# Altium schematic sheet 1_P1.schdoc
size 429 x 307 mm; Symbol: Sheet-Symbol_A4; Device: Sheet-Symbol_A4; Company: 嘉立创EDA; Version: V1.0; Page Size: A4; @Project Name: BMCU-V0.6; @Page Count: 1; @Update Date: 2025-03-16; @Create Date: 2024-12-15; @Schematic Name: Schematic1_1; @Page No: 1; @Page Name: P1; Title Block Position: 3; Width: 1655; Height: 1170; Region Start: 1; X Region Count: 6; Y Region Count: 4; Blade Width: 10; @Board Name: 组件板; @Create Time: 07:27:27; @Update Time: 17:54:20
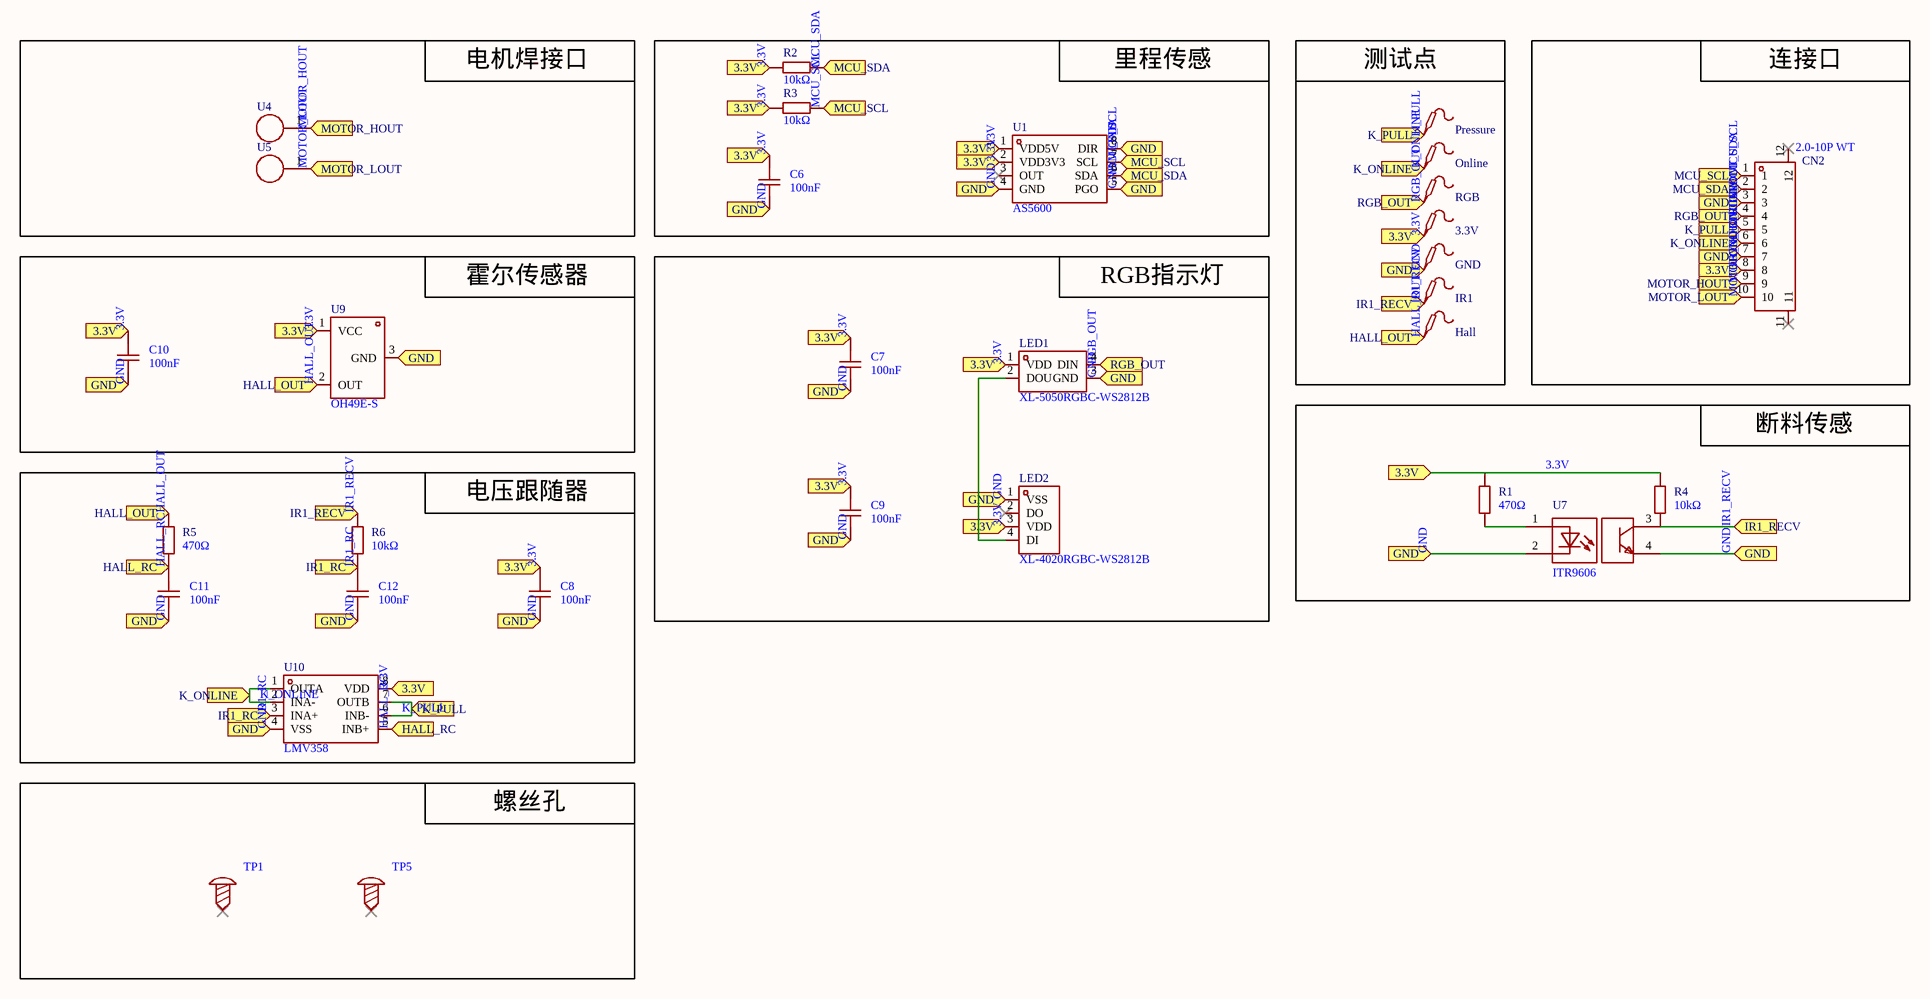
[diagram p0: 1_P1.schdoc]

## Parts
3.3V  (no value)  [Test-Point-0.5mm]
C6  100nF  [C0603]
C7  100nF  [C0603]
C8  100nF  [C0603]
C9  100nF  [C0603]
C10  100nF  [C0603]
C11  100nF  [C0603]
C12  100nF  [C0603]
CN2  2.0-10P WT  [CONN-SMD_10P-P2.00_2.0-10P-WT]
GND  (no value)  [Test-Point-0.5mm]
Hall  (no value)  [Test-Point-0.5mm]
IR1  (no value)  [Test-Point-0.5mm]
LED1  XL-5050RGBC-WS2812B  [LED-SMD_4P-L5.0-W5.0-BL_XL-5050RGBC]
LED2  XL-4020RGBC-WS2812B  [LED-SMD_4P-L4.0-W1.7_XL-4020RGBC-WS2812B]
Online  (no value)  [Test-Point-0.5mm]
Pressure  (no value)  [Test-Point-0.5mm]
R1  470Ω  [R0603]
R2  10kΩ  [R0603]
R3  10kΩ  [R0603]
R4  10kΩ  [R0603]
R5  470Ω  [R0603]
R6  10kΩ  [R0603]
RGB  (no value)  [Test-Point-0.5mm]
TP1  (no value)  [M2螺丝]
TP5  (no value)  [M2螺丝]
U1  AS5600  [SOIC-8_L4.9-W3.9-P1.27-LS6.0-BL]
U4  1625854-2  [TEST-RING]  (value not drawn)
U5  1625854-2  [TEST-RING]  (value not drawn)
U7  ITR9606  [OPTO-TH_4P_ITR9606]
U9  OH49E-S  [SOT-23-3_L2.9-W1.6-P1.90-LS2.8-BR]
U10  LMV358  [SOP-8_L4.9-W3.9-P1.27-LS6.0-BL]

## Blocks framed on the sheet
电机焊接口: U4 U5
里程传感: C6 R2 R3 U1
测试点: 3.3V GND Hall IR1 Online Pressure RGB
连接口: CN2
霍尔传感器: C10 U9
RGB指示灯: C7 C9 LED1 LED2
断料传感: R1 R4 U7
电压跟随器: C8 C11 C12 R5 R6 U10
螺丝孔: TP1 TP5

## Ports
3.3V (in), GND (in), HALL_OUT (in), HALL_RC (in), IR1_RC (in), IR1_RECV (in), K_ONLINE (in), K_PULL (in), MCU_SCL (in), MCU_SDA (in), MOTOR_HOUT (in), MOTOR_LOUT (in), RGB_OUT (in)

## Nets
3.3V: 3.3V.1 C6.2 C7.2 C8.2 C9.2 C10.2 CN2.8 LED1.1(VDD) LED2.3(VDD) R1.1 R2.1 R3.1 R4.1 U1.1(VDD5V) U1.2(VDD3V3) U9.1(VCC) U10.8(VDD) ; port 3.3V
GND: C6.1 C7.1 C8.1 C9.1 C10.1 C11.1 C12.1 CN2.3 CN2.7 GND.1 LED1.3(GND) LED2.1(VSS) U1.4(GND) U1.5(PGO) U1.8(DIR) U7.2 U7.4 U9.3(GND) U10.4(VSS) ; port GND
HALL_OUT: Hall.1 R5.1 U9.2(OUT) ; port HALL_OUT
HALL_RC: C11.2 R5.2 U10.5(INB+) ; port HALL_RC
IR1_RC: C12.2 R6.1 U10.3(INA+) ; port IR1_RC
IR1_RECV: IR1.1 R4.2 R6.2 U7.3 ; port IR1_RECV
K_ONLINE: CN2.6 Online.1 U10.1(OUTA) U10.2(INA-) ; port K_ONLINE
K_PULL: CN2.5 Pressure.1 U10.6(INB-) U10.7(OUTB) ; port K_PULL
MCU_SCL: CN2.1 R3.2 U1.7(SCL) ; port MCU_SCL
MCU_SDA: CN2.2 R2.2 U1.6(SDA) ; port MCU_SDA
MOTOR_HOUT: CN2.9 U4.1 ; port MOTOR_HOUT
MOTOR_LOUT: CN2.10 U5.1 ; port MOTOR_LOUT
RGB_OUT: CN2.4 LED1.4(DIN) RGB.1 ; port RGB_OUT
NetLED1_2: LED1.2(DOU) LED2.4(DI)
NetR1_2: R1.2 U7.1

Not connected (* = marked no-connect by the designer): CN2 11* 12*; LED2 2(DO)*; TP1 1*; TP5 1*; U1 3(OUT)*

## Notes on the sheet
- 1
- 2
- 3
- 4
- 5
- 6
- A
- B
- C
- 原理图
- Schematic1_1
- 创建日期
- 更新日期
- 2025-03-16
- 2024-12-15
- D
- 绘制
- 图页
- P1
- 物料编码
- 审阅
- 版本
- 尺寸
- BMCU-V0.6
- 页
- 共
- V1.0
- A4
- 嘉立创EDA

## Library data of the parts
3.3V GND Hall IR1 Online Pressure RGB = Test-Point: Add into BOM: yes; Symbol: Test-Point; Device: Test-Point; Convert to PCB: yes
C6-C12 = CC0603KRX7R9BB104: Manufacturer: YAGEO(国巨); Symbol: CapAcitance; Add into BOM: yes; Tolerance: ±10%; Voltage Rated: 50V; Temperature Coefficient: X7R; Device: CC0603KRX7R9BB104; LCSC Part Name: 100nF ±10% 50V; Supplier Part: C14663; Manufacturer Part: CC0603KRX7R9BB104; Supplier Footprint: 0603; JLCPCB Part Class: Basic Part; Datasheet: https://atta.szlcsc.com/upload/public/pdf/source/20180910/C282072_33301C7F631E79921B82A8DAC6BCC5B3.pdf; Supplier: LCSC; Convert to PCB: yes; Value: 100nF
CN2 = 2.0-10P WT: Manufacturer: SHOU HAN(首韩); Add into BOM: yes; Pins Structure: 1x10P; Pitch: 2mm; Reference Series: PH; Number of PINs Per Row: 10; Current Rating (Max): 2A; Symbol: 2.0-10P WT; Device: 2.0-10P WT; LCSC Part Name: 间距:2mm 1x10P 卧贴; Supplier Part: C5340818; Manufacturer Part: 2.0-10P WT; Supplier Footprint: SMD,P=2mm,卧贴; Datasheet: https://atta.szlcsc.com/upload/public/pdf/source/20221228/2B469FB976A3BE7FA48F92FFEBDB46D7.pdf; Supplier: LCSC; Convert to PCB: yes; Mounting Style: 卧贴; Number of Pins: 10P; Number of Rows: 1; Operating Temperature Range: -25℃~+85℃
LED1 = XL-5050RGBC-WS2812B: Manufacturer: XINGLIGHT(成兴光); Add into BOM: yes; Symbol: XL-5050RGBC-WS2812B; Device: XL-5050RGBC-WS2812B; LCSC Part Name: XL-5050RGBC-WS2812B; Supplier Part: C2843785; Manufacturer Part: XL-5050RGBC-WS2812B; Supplier Footprint: SMD5050; Datasheet: https://atta.szlcsc.com/upload/public/pdf/source/20240412/E1004CAA80592E31D08BFE019083806F.pdf; Supplier: LCSC; Convert to PCB: yes
LED2 = XL-4020RGBC-WS2812B: Manufacturer: XINGLIGHT(成兴光); Add into BOM: yes; Symbol: XL-4020RGBC-WS2812B; Device: XL-4020RGBC-WS2812B; LCSC Part Name: XL-4020RGBC-WS2812B; Supplier Part: C3647024; Manufacturer Part: XL-4020RGBC-WS2812B; Supplier Footprint: SMD,2x4mm; JLCPCB Part Class: 扩展库; Datasheet: https://atta.szlcsc.com/upload/public/pdf/source/20240229/191D5186283B54A17967D79876487C73.pdf; Supplier: LCSC; Convert to PCB: yes
R1 R5 = 0603WAF4700T5E: Manufacturer: UNI-ROYAL(厚声); Add into BOM: yes; Tolerance: ±1%; Power(Watts): 100mW; Overload Voltage (Max): 75V; Temperature Coefficient: ±100ppm/℃; Symbol: 0603WAF4700T5E; Device: 0603WAF4700T5E; LCSC Part Name: 470Ω ±1% 100mW 厚膜电阻; Supplier Part: C23179; Manufacturer Part: 0603WAF4700T5E; Supplier Footprint: 0603; Datasheet: https://atta.szlcsc.com/upload/public/pdf/source/20200306/C422600_1E6D84923E4A46A82E41ADD87F860B5C.pdf; Supplier: LCSC; Convert to PCB: yes; Type: 厚膜电阻; Value: 470Ω; Operating Temperature Range: -55℃~+155℃
R2-R4 R6 = 0603WAF1002T5E: Manufacturer: UNI-ROYAL(厚声); Add into BOM: yes; Tolerance: ±1%; Power(Watts): 100mW; Overload Voltage (Max): 75V; Temperature Coefficient: ±100ppm/℃; Symbol: 0603WAF1002T5E; Device: 0603WAF1002T5E; LCSC Part Name: 厚膜电阻 10kΩ ±1% 100mW; Supplier Part: C25804; Manufacturer Part: 0603WAF1002T5E; Supplier Footprint: 0603; JLCPCB Part Class: 基础库; Datasheet: https://atta.szlcsc.com/upload/public/pdf/source/20200306/C422600_1E6D84923E4A46A82E41ADD87F860B5C.pdf; Supplier: LCSC; Convert to PCB: yes; Type: 厚膜电阻; Value: 10kΩ; Operating Temperature Range: -55℃~+155℃
TP1 TP5 = M2螺丝: Symbol: 螺丝孔; Convert to PCB: yes; Device: M2螺丝; Add into BOM: yes; Supplier Footprint: 插件
U1 = AS5600: Add into BOM: yes; Symbol: AS5600; Device: AS5600; LCSC Part Name: AS5600; Supplier Part: C9900021040; Manufacturer Part: AS5600; Supplier Footprint: SOIC-8; Supplier: LCSC; Convert to PCB: yes
U4 U5 = 1625854-2: Manufacturer: TE Connectivity(泰科电子); Add into BOM: yes; Symbol: 1625854-2; Device: 1625854-2; LCSC Part Name: 1625854-2; Supplier Part: C306063; Manufacturer Part: 1625854-2; Supplier Footprint: -; JLCPCB Part Class: 扩展库; Datasheet: https://atta.szlcsc.com/upload/public/pdf/source/20221209/97BE41A51F1CE3ECBA7573F39B62A732.pdf; Supplier: LCSC; Convert to PCB: yes
U7 = ITR9606: Manufacturer: EVERLIGHT(亿光); Add into BOM: yes; Symbol: ITR9606; Device: ITR9606; LCSC Part Name: 5mm 光中断器; Supplier Part: C264271; Manufacturer Part: ITR9606; Supplier Footprint: DIP-4; Datasheet: https://atta.szlcsc.com/upload/public/pdf/source/20180817/C264271_0A5A08AFBE67158755A762373070CED7.pdf; Supplier: LCSC; Convert to PCB: yes
U9 = OH49E-S: Manufacturer: 南京欧卓; Add into BOM: yes; Symbol: OH49E-S; Device: OH49E-S; LCSC Part Name: 线性霍尔开关电路; Supplier Part: C85573; Manufacturer Part: OH49E-S; Supplier Footprint: SOT-23; JLCPCB Part Class: 扩展库; Datasheet: https://atta.szlcsc.com/upload/public/pdf/source/20170824/C85573_1503566162060907583.pdf; Supplier: LCSC; Convert to PCB: yes
U10 = LMV358: Manufacturer: TECH PUBLIC(台舟); Symbol: LMV358_C2923376; Add into BOM: yes; Maximum Power Supply Range (Vdd-Vss): 5.5V; Rail to Rail: 轨到轨输入,轨到轨输出; Gain Bandwidth Product(GBP): 1MHz; Voltage - Input Offset(Vos): 5mV; Input Offset Voltage Drift (Vos TC): 2uV/℃; Slew Rate(SR): 0.6V/us; Noise density(eN): 20nV/√Hz@10kHz; Common Mode Rejection Ratio (CMRR): 65dB; Device: LMV358; LCSC Part Name: LMV358; Supplier Part: C2923376; Manufacturer Part: LMV358; Supplier Footprint: SOP-8; Datasheet: https://atta.szlcsc.com/upload/public/pdf/source/20211125/73A2622E62D548ADC8514436842F6162.pdf; Supplier: LCSC; Convert to PCB: yes